# Altium schematic sheet resource.SchDoc
size A2
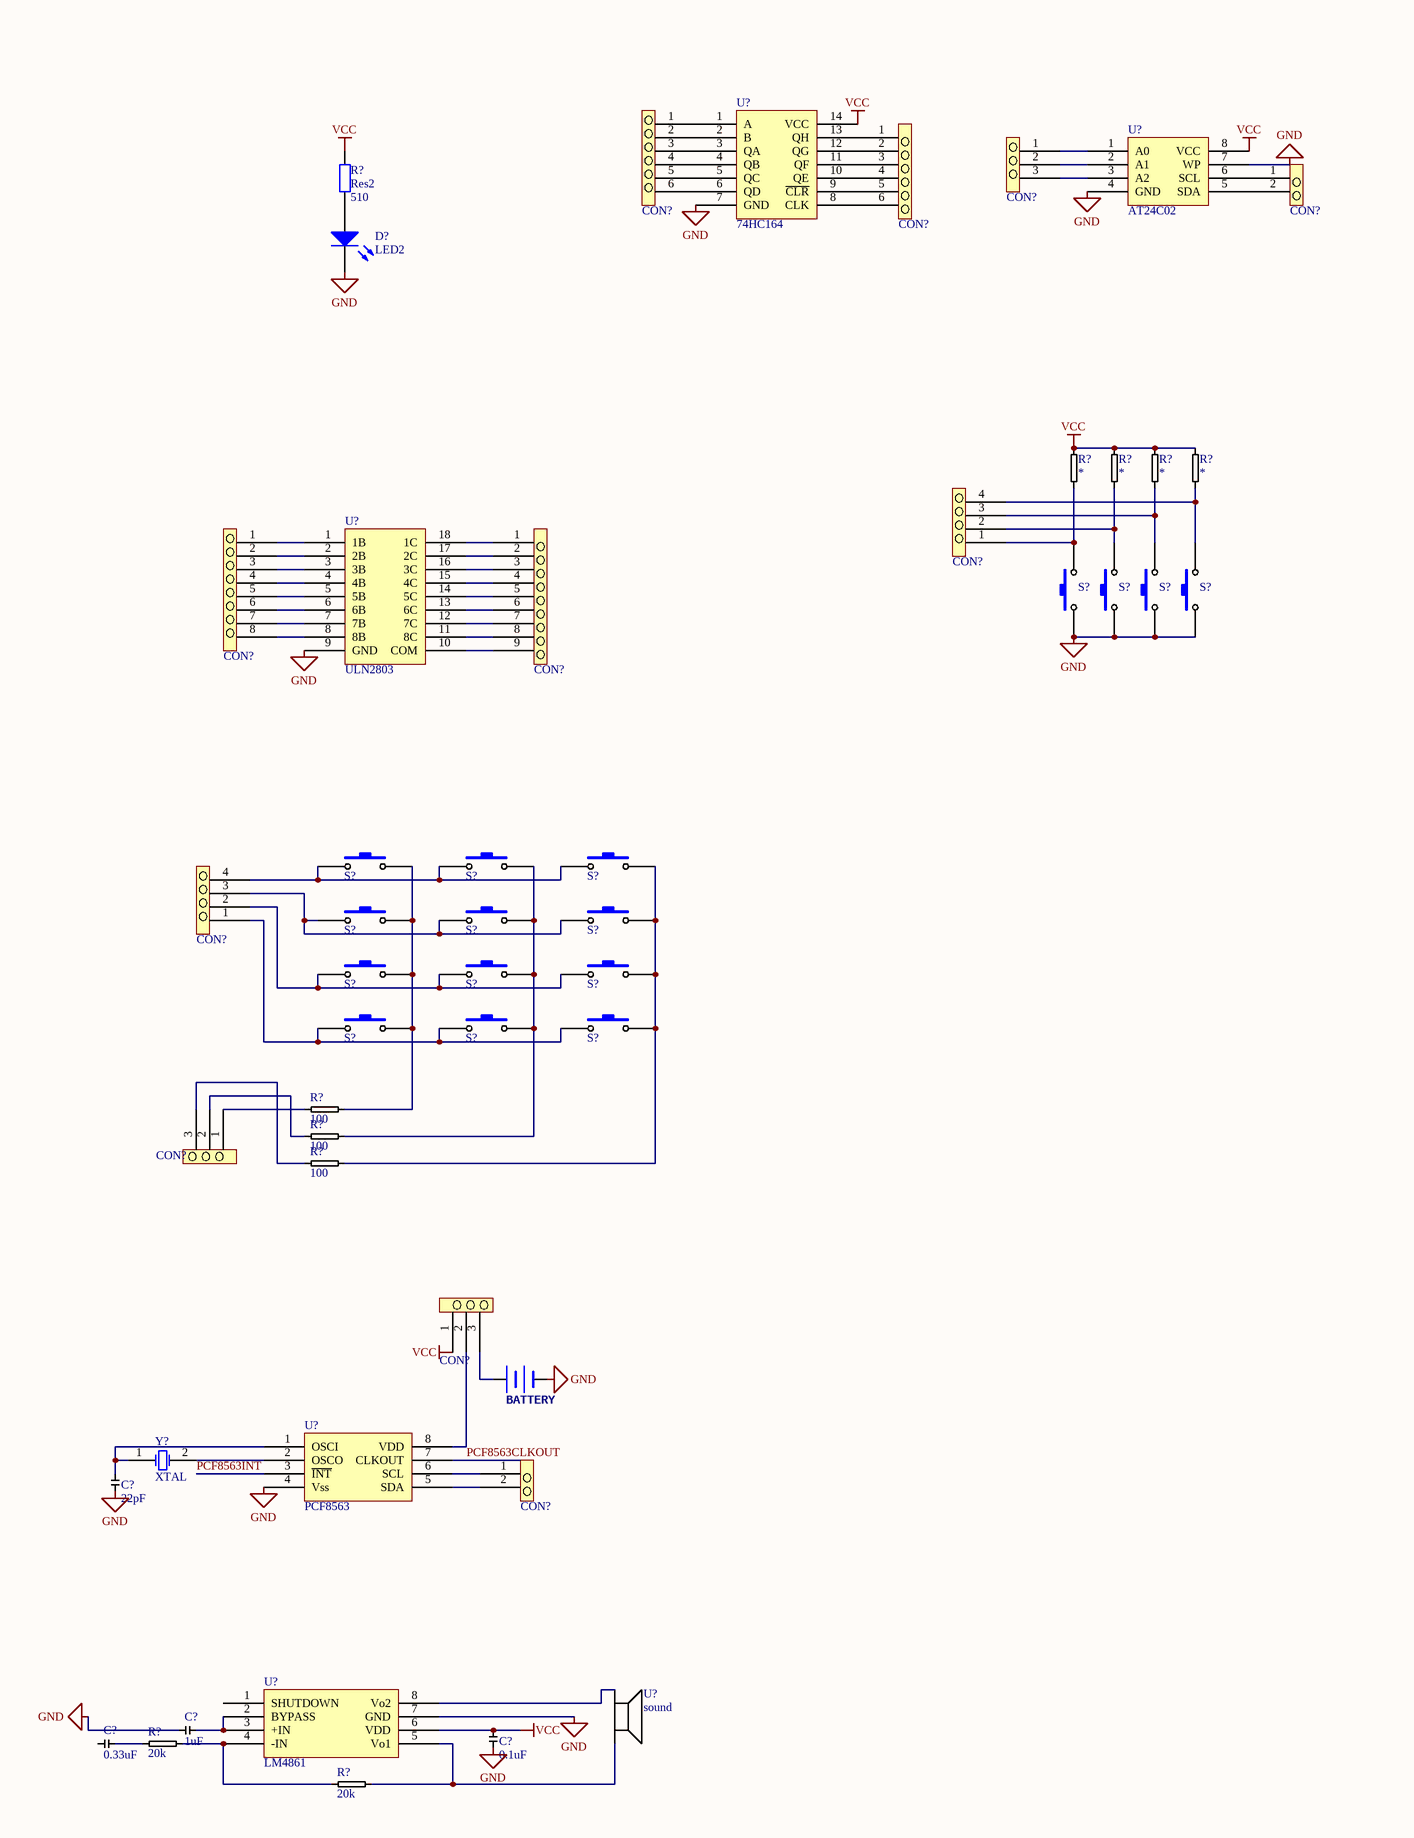
[diagram p0: resource.SchDoc, left]
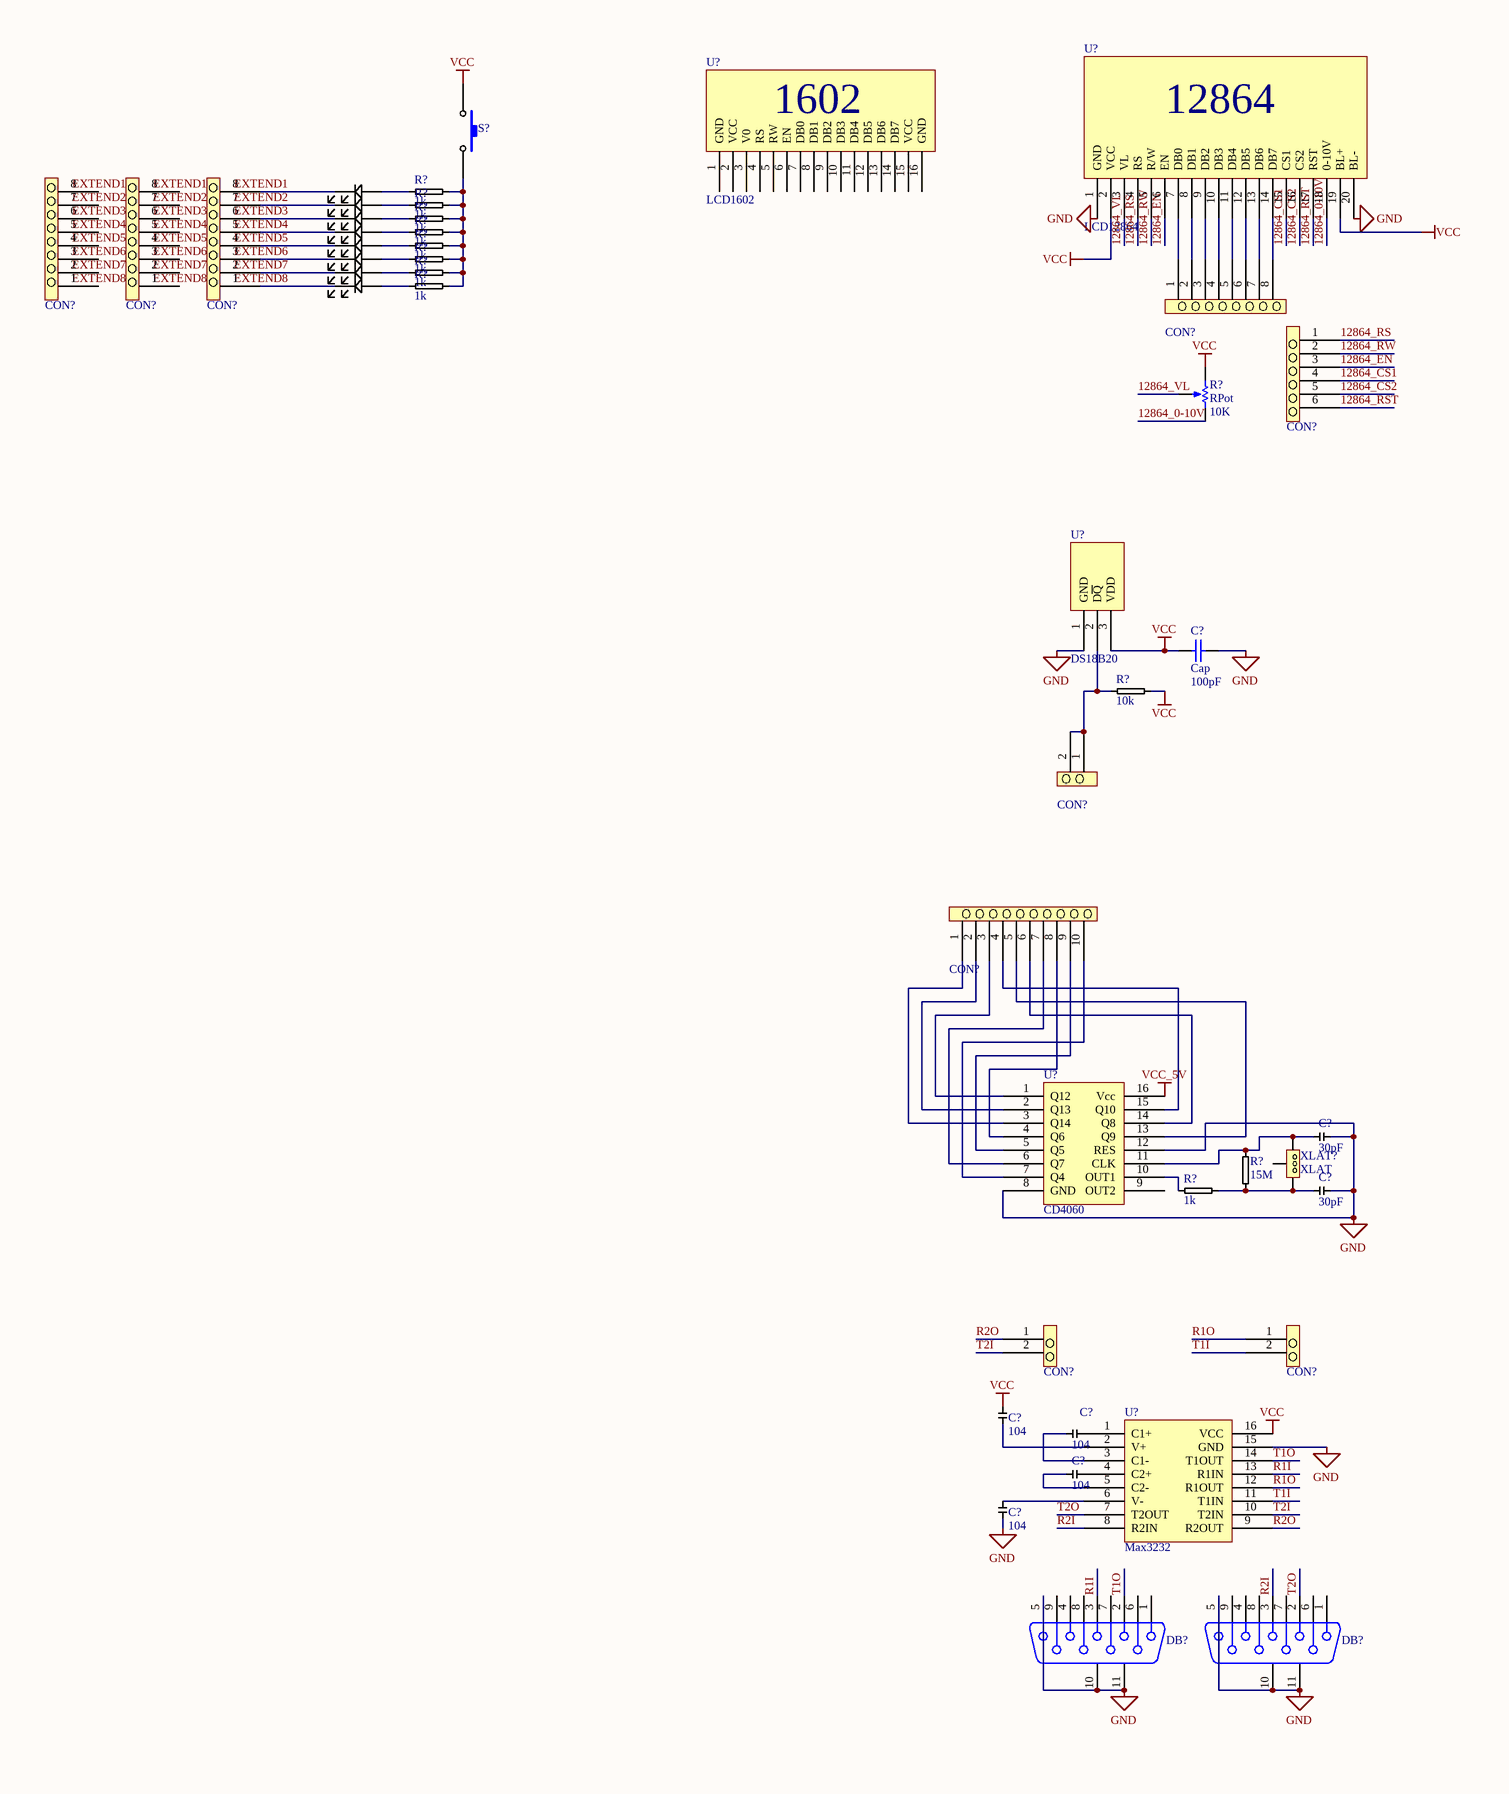
[diagram p1: resource.SchDoc, right]

## Parts
(Parts that share a designator on the sheet are numbered #1, #2 ... from top to bottom, then left to right.)
BT1  BATTERY  [BAT]
C?#1  Cap  value 100pF  [RAD-0.3]
C?#2  value 30pF  [0805]  (hidden comment: CAP)
C?#3  value 30pF  [0805]  (hidden comment: CAP)
C?#4  value 104  [0805]  (hidden comment: CAP)
C?#5  value 104  [0805]  (hidden comment: CAP)
C?#6  value 104  [0805]  (hidden comment: CAP)
C?#7  value 104  [0805]  (hidden comment: CAP)
C?#8  value 22pF  [0805]  (hidden comment: CAP)
C?#9  value 1uF  [0805]  (hidden comment: CAP)
C?#10  value 0.33uF  [0805]  (hidden comment: CAP)
C?#11  value 0.1uF  [0805]  (hidden comment: CAP)
CON?#1  Connector6  [SIP6]  (value not drawn)
CON?#2  Connector6  [SIP6]  (value not drawn)
CON?#3  Connector3  [SIP3]  (value not drawn)
CON?#4  Connector2  [SIP3]  (value not drawn)
CON?#5  Connector8  [SIP4]  (value not drawn)
CON?#6  Connector8  [SIP4]  (value not drawn)
CON?#7  Connector8  [SIP4]  (value not drawn)
CON?#8  Connector8  [SIP4]  (value not drawn)
CON?#9  Connector6  [SIP6]  (value not drawn)
CON?#10  Connector8  [SIP4]  (value not drawn)
CON?#11  Connector9  [SIP4]  (value not drawn)
CON?#12  Connector4  [SIP4]  (value not drawn)
CON?#13  Connector2  [SIP3]  (value not drawn)
CON?#14  Connector10  [SIP4]  (value not drawn)
CON?#15  Connector4  [SIP4]  (value not drawn)
CON?#16  Connector3  [SIP3]  (value not drawn)
CON?#17  Connector2  [SIP3]  (value not drawn)
CON?#18  Connector2  [SIP3]  (value not drawn)
CON?#19  Connector3  [SIP3]  (value not drawn)
CON?#20  Connector2  [SIP3]  (value not drawn)
D?  LED2  [LEDPOWER]
DB?#1  D Connector 9  [DB9_2]  (value not drawn)
DB?#2  D Connector 9  [DB9_2]  (value not drawn)
LED?#1  LED  [LEDpower]  (value not drawn)
LED?#2  LED  [LEDpower]  (value not drawn)
LED?#3  LED  [LEDpower]  (value not drawn)
LED?#4  LED  [LEDpower]  (value not drawn)
LED?#5  LED  [LEDpower]  (value not drawn)
LED?#6  LED  [LEDpower]  (value not drawn)
LED?#7  LED  [LEDpower]  (value not drawn)
LED?#8  LED  [LEDpower]  (value not drawn)
R?#1  value 1k  [0805]  (hidden comment: RESISTOR)
R?#2  value 1k  [0805]  (hidden comment: RESISTOR)
R?#3  value 1k  [0805]  (hidden comment: RESISTOR)
R?#4  value 1k  [0805]  (hidden comment: RESISTOR)
R?#5  Res2  value 510  [0805]
R?#6  value 1k  [0805]  (hidden comment: RESISTOR)
R?#7  value 1k  [0805]  (hidden comment: RESISTOR)
R?#8  value 1k  [0805]  (hidden comment: RESISTOR)
R?#9  value 1k  [0805]  (hidden comment: RESISTOR)
R?#10  RPot  value 10K  [VR5]
R?#11  RESISTOR  [0805]  (value not drawn)
R?#12  RESISTOR  [0805]  (value not drawn)
R?#13  RESISTOR  [0805]  (value not drawn)
R?#14  RESISTOR  [0805]  (value not drawn)
R?#15  value 10k  [0805]  (hidden comment: RESISTOR)
R?#16  value 100  [0805]  (hidden comment: RESISTOR)
R?#17  value 15M  [0805]  (hidden comment: RESISTOR)
R?#18  value 100  [0805]  (hidden comment: RESISTOR)
R?#19  value 1k  [0805]  (hidden comment: RESISTOR)
R?#20  value 100  [0805]  (hidden comment: RESISTOR)
R?#21  value 20k  [0805]  (hidden comment: RESISTOR)
R?#22  value 20k  [0805]  (hidden comment: RESISTOR)
S?#1  SW-PB  [SW-PB]  (value not drawn)
S?#2  SW-PB  [SW-PB]  (value not drawn)
S?#3  SW-PB  [SW-PB]  (value not drawn)
S?#4  SW-PB  [SW-PB]  (value not drawn)
S?#5  SW-PB  [SW-PB]  (value not drawn)
S?#6  SW-PB  [SW-PB]  (value not drawn)
S?#7  SW-PB  [SW-PB]  (value not drawn)
S?#8  SW-PB  [SW-PB]  (value not drawn)
S?#9  SW-PB  [SW-PB]  (value not drawn)
S?#10  SW-PB  [SW-PB]  (value not drawn)
S?#11  SW-PB  [SW-PB]  (value not drawn)
S?#12  SW-PB  [SW-PB]  (value not drawn)
S?#13  SW-PB  [SW-PB]  (value not drawn)
S?#14  SW-PB  [SW-PB]  (value not drawn)
S?#15  SW-PB  [SW-PB]  (value not drawn)
S?#16  SW-PB  [SW-PB]  (value not drawn)
S?#17  SW-PB  [SW-PB]  (value not drawn)
U?#1  LCD12864
U?#2  LCD1602
U?#3  74HC164  [DIP14]
U?#4  AT24C02  [DIP8]
U?#5  DS18B20
U?#6  ULN2803  [DIP18]
U?#7  CD4060  [DIP16]
U?#8  PCF8563  [SOP8]
U?#9  Max3232  [SOP16]
U?#10  LM4861
U?#11  sound
XLAT?  XLAT
Y?  XTAL  [BCY-W2/D3.1]

## Nets
GND: BT1.2(-) C?#1.2 C?#2.2 C?#3.2 C?#7.2 C?#8.1 C?#9.1 C?#11.1 D?.2(K) DB?#1.5 DB?#1.10(MH1) DB?#1.11(MH2) DB?#2.5 DB?#2.10(MH1) DB?#2.11(MH2) S?#2.1 S?#3.1 S?#4.1 S?#5.1 U?#1.1(GND) U?#1.20(BL-) U?#3.7(GND) U?#4.4(GND) U?#4.7(WP) U?#5.1(GND) U?#6.9(GND) U?#7.8(GND) U?#7.12(RES) U?#8.4(Vss) U?#9.15(GND) U?#10.7(GND)
VCC: C?#1.1 C?#4.2 C?#11.2 CON?#19.1 R?#5.2 R?#10.1(TOP) R?#11.2 R?#12.2 R?#13.2 R?#14.2 R?#15.2 S?#1.1 U?#1.2(VCC) U?#1.19(BL+) U?#3.14(VCC) U?#4.8(VCC) U?#5.3(VDD) U?#9.16(VCC) U?#10.6(VDD)
VCC_5V: U?#7.16(Vcc)
12864_0-10V: R?#10.2(BOT) U?#1.18(0-10V)
12864_CS1: CON?#9.4 U?#1.15(CS1)
12864_CS2: CON?#9.5 U?#1.16(CS2)
12864_EN: CON?#9.3 U?#1.6(EN)
12864_RS: CON?#9.1 U?#1.4(RS)
12864_RST: CON?#9.6 U?#1.17(RST)
12864_RW: CON?#9.2 U?#1.5(R/W)
12864_VL: R?#10.3(TAP) U?#1.3(VL)
PCF8563CLKOUT: U?#8.7(CLKOUT)
PCF8563INT: U?#8.3(~{INT})
R1I: DB?#1.3 U?#9.13(R1IN)
R1O: CON?#18.1 U?#9.12(R1OUT)
R2I: DB?#2.3 U?#9.8(R2IN)
R2O: CON?#17.1 U?#9.9(R2OUT)
T1I: CON?#18.2 U?#9.11(T1IN)
T1O: DB?#1.2 U?#9.14(T1OUT)
T2I: CON?#17.2 U?#9.10(T2IN)
T2O: DB?#2.2 U?#9.7(T2OUT)
NetBT1_1: BT1.1(+) CON?#19.3
NetC?#2_1: C?#2.1 R?#17.2 U?#7.11(CLK) XLAT?.1
NetC?#3_1: C?#3.1 R?#17.1 R?#19.2 XLAT?.2
NetC?#4_1: C?#4.1 U?#9.2(V+)
NetC?#5_1: C?#5.1 U?#9.1(C1+)
NetC?#5_2: C?#5.2 U?#9.3(C1-)
NetC?#6_1: C?#6.1 U?#9.4(C2+)
NetC?#6_2: C?#6.2 U?#9.5(C2-)
NetC?#7_1: C?#7.1 U?#9.6(V-)
NetC?#8_2: C?#8.2 U?#8.1(OSCI) Y?.1(OSC1)
NetC?#9_2: C?#9.2 U?#10.2(BYPASS) U?#10.3(+IN)
NetC?#10_2: C?#10.2 R?#21.1
NetCON?#1_1: CON?#1.1 U?#3.1(A)
NetCON?#1_2: CON?#1.2 U?#3.2(B)
NetCON?#1_3: CON?#1.3 U?#3.3(QA)
NetCON?#1_4: CON?#1.4 U?#3.4(QB)
NetCON?#1_5: CON?#1.5 U?#3.5(QC)
NetCON?#1_6: CON?#1.6 U?#3.6(QD)
NetCON?#2_1: CON?#2.1 U?#3.13(QH)
NetCON?#2_2: CON?#2.2 U?#3.12(QG)
NetCON?#2_3: CON?#2.3 U?#3.11(QF)
NetCON?#2_4: CON?#2.4 U?#3.10(QE)
NetCON?#2_5: CON?#2.5 U?#3.9(~{CLR})
NetCON?#2_6: CON?#2.6 U?#3.8(CLK)
NetCON?#3_1: CON?#3.1 U?#4.1(A0)
NetCON?#3_2: CON?#3.2 U?#4.2(A1)
NetCON?#3_3: CON?#3.3 U?#4.3(A2)
NetCON?#4_1: CON?#4.1 U?#4.6(SCL)
NetCON?#4_2: CON?#4.2 U?#4.5(SDA)
NetCON?#7_1: CON?#7.1 LED?#8.2
NetCON?#7_2: CON?#7.2 LED?#7.2
NetCON?#7_3: CON?#7.3 LED?#6.2
NetCON?#7_4: CON?#7.4 LED?#5.2
NetCON?#7_5: CON?#7.5 LED?#4.2
NetCON?#7_6: CON?#7.6 LED?#3.2
NetCON?#7_7: CON?#7.7 LED?#2.2
NetCON?#7_8: CON?#7.8 LED?#1.2
NetCON?#8_1: CON?#8.1 U?#1.7(DB0)
NetCON?#8_2: CON?#8.2 U?#1.8(DB1)
NetCON?#8_3: CON?#8.3 U?#1.9(DB2)
NetCON?#8_4: CON?#8.4 U?#1.10(DB3)
NetCON?#8_5: CON?#8.5 U?#1.11(DB4)
NetCON?#8_6: CON?#8.6 U?#1.12(DB5)
NetCON?#8_7: CON?#8.7 U?#1.13(DB6)
NetCON?#8_8: CON?#8.8 U?#1.14(DB7)
NetCON?#10_1: CON?#10.1 U?#6.1(1B)
NetCON?#10_2: CON?#10.2 U?#6.2(2B)
NetCON?#10_3: CON?#10.3 U?#6.3(3B)
NetCON?#10_4: CON?#10.4 U?#6.4(4B)
NetCON?#10_5: CON?#10.5 U?#6.5(5B)
NetCON?#10_6: CON?#10.6 U?#6.6(6B)
NetCON?#10_7: CON?#10.7 U?#6.7(7B)
NetCON?#10_8: CON?#10.8 U?#6.8(8B)
NetCON?#11_1: CON?#11.1 U?#6.18(1C)
NetCON?#11_2: CON?#11.2 U?#6.17(2C)
NetCON?#11_3: CON?#11.3 U?#6.16(3C)
NetCON?#11_4: CON?#11.4 U?#6.15(4C)
NetCON?#11_5: CON?#11.5 U?#6.14(5C)
NetCON?#11_6: CON?#11.6 U?#6.13(6C)
NetCON?#11_7: CON?#11.7 U?#6.12(7C)
NetCON?#11_8: CON?#11.8 U?#6.11(8C)
NetCON?#11_9: CON?#11.9 U?#6.10(COM)
NetCON?#12_1: CON?#12.1 R?#11.1 S?#2.2
NetCON?#12_2: CON?#12.2 R?#12.1 S?#3.2
NetCON?#12_3: CON?#12.3 R?#13.1 S?#4.2
NetCON?#12_4: CON?#12.4 R?#14.1 S?#5.2
NetCON?#13_1: CON?#13.1 CON?#13.2 R?#15.1 U?#5.2(D~{Q})
NetCON?#14_1: CON?#14.1 U?#7.3(Q14)
NetCON?#14_2: CON?#14.2 U?#7.2(Q13)
NetCON?#14_3: CON?#14.3 U?#7.1(Q12)
NetCON?#14_4: CON?#14.4 U?#7.15(Q10)
NetCON?#14_5: CON?#14.5 U?#7.13(Q9)
NetCON?#14_6: CON?#14.6 U?#7.14(Q8)
NetCON?#14_7: CON?#14.7 U?#7.6(Q7)
NetCON?#14_8: CON?#14.8 U?#7.4(Q6)
NetCON?#14_9: CON?#14.9 U?#7.5(Q5)
NetCON?#14_10: CON?#14.10 U?#7.7(Q4)
NetCON?#15_1: CON?#15.1 S?#15.1 S?#16.1 S?#17.1
NetCON?#15_2: CON?#15.2 S?#12.1 S?#13.1 S?#14.1
NetCON?#15_3: CON?#15.3 S?#9.1 S?#10.1 S?#11.1
NetCON?#15_4: CON?#15.4 S?#6.1 S?#7.1 S?#8.1
NetCON?#16_1: CON?#16.1 R?#16.1
NetCON?#16_2: CON?#16.2 R?#18.1
NetCON?#16_3: CON?#16.3 R?#20.1
NetCON?#19_2: CON?#19.2 U?#8.8(VDD)
NetCON?#20_1: CON?#20.1 U?#8.6(SCL)
NetCON?#20_2: CON?#20.2 U?#8.5(SDA)
NetD?_1: D?.1(A) R?#5.1
NetLED?#1_1: LED?#1.1 R?#1.1
NetLED?#2_1: LED?#2.1 R?#2.1
NetLED?#3_1: LED?#3.1 R?#3.1
NetLED?#4_1: LED?#4.1 R?#4.1
NetLED?#5_1: LED?#5.1 R?#6.1
NetLED?#6_1: LED?#6.1 R?#7.1
NetLED?#7_1: LED?#7.1 R?#8.1
NetLED?#8_1: LED?#8.1 R?#9.1
NetR?#1_2: R?#1.2 R?#2.2 R?#3.2 R?#4.2 R?#6.2 R?#7.2 R?#8.2 R?#9.2 S?#1.2
NetR?#16_2: R?#16.2 S?#6.2 S?#9.2 S?#12.2 S?#15.2
NetR?#18_2: R?#18.2 S?#7.2 S?#10.2 S?#13.2 S?#16.2
NetR?#19_1: R?#19.1 U?#7.10(OUT1)
NetR?#20_2: R?#20.2 S?#8.2 S?#11.2 S?#14.2 S?#17.2
NetR?#21_2: R?#21.2 R?#22.1 U?#10.4(-IN)
NetR?#22_2: R?#22.2 U?#10.5(Vo1) U?#11.2
NetU?#8_2: U?#8.2(OSCO) Y?.2(OSC2)
NetU?#10_8: U?#10.8(Vo2) U?#11.1

Not connected (* = marked no-connect by the designer): C?#10 1; CON?#5 1 2 3 4 5 6 7 8; CON?#6 1 2 3 4 5 6 7 8; DB?#1 1 4 6 7 8 9; DB?#2 1 4 6 7 8 9; U?#2 1(GND) 2(VCC) 3(V0) 4(RS) 5(RW) 6(EN) 7(DB0) 8(DB1) 9(DB2) 10(DB3) 11(DB4) 12(DB5) 13(DB6) 14(DB7) 15(VCC) 16(GND); U?#7 9(OUT2); U?#10 1(SHUTDOWN); XLAT? ?1

## Notes on the sheet
- Labels drawn without touching a wire or pin: EXTEND1, EXTEND2, EXTEND3, EXTEND4, EXTEND5, EXTEND6, EXTEND7, EXTEND8
- (in symbol LCD1602) 1602
- (in symbol LCD12864) 12864

## Library data of the parts
C?#1 = Cap: Capacitor; Published: 8-Jun-2000; LatestRevisionDate: 17-Jul-2002; LatestRevisionNote: Re-released for DXP Platform.; PackageReference: RAD-0.3; Publisher: Altium Limited
D? = LED2: Typical RED, GREEN, YELLOW, AMBER GaAs LED; Published: 8-Jun-2000; LatestRevisionDate: 17-Jul-2002; LatestRevisionNote: Re-released for DXP Platform.; PackageVersion: Feb-2002; PackageReference: 3.2X1.6X1.1; Publisher: Altium Limited
DB?#1 DB?#2 = D Connector 9: Receptacle Assembly, 9 Position, Right Angle; PackageDocument: O; Positions: 9; Published: 15-Jun-2001; LatestRevisionDate: 17-Jul-2002; LatestRevisionNote: Re-released for DXP Platform.; DatasheetDocument: 1-Sep-1999; PackageReference: 788750; Publisher: Altium Limited; Orientation: Right Angle; Gender: Receptacle
R?#1-R?#4 R?#6-R?#9 R?#11-R?#22 = RES
  R?#11-R?#14: VALUE: *
R?#5 = Res2: Resistor; Published: 8-Jun-2000; LatestRevisionDate: 17-Jul-2002; LatestRevisionNote: Re-released for DXP Platform.; PackageReference: AXIAL-0.4; Publisher: Altium Limited
R?#10 = RPot: Potentiometer; Sim Note: Enter the Resistance value and the set point into parameter fields.; Set Position: 0.5; Published: 8-Jun-2000; LatestRevisionDate: 17-Jul-2002; LatestRevisionNote: Re-released for DXP Platform.; PackageReference: VR5; Publisher: Altium Limited
S?#1-S?#17 = SW-PB: Switch; Published: 24-Mar-1999; LatestRevisionDate: 17-Jul-2002; LatestRevisionNote: Re-released for DXP Platform.; PackageReference: SPST-2; Publisher: Altium Limited
XLAT? = MYXLAT: VALUE: 2.048M
Y? = XTAL: Crystal Oscillator; Published: 8-Jun-2000; LatestRevisionDate: 17-Jul-2002; LatestRevisionNote: Re-released for DXP Platform.; PackageReference: R38; Publisher: Altium Limited